# EAGLE design Quad-Load-Cell-Amplifier-to-RS-485-Conv-Module (EAGLE 9.6.2)
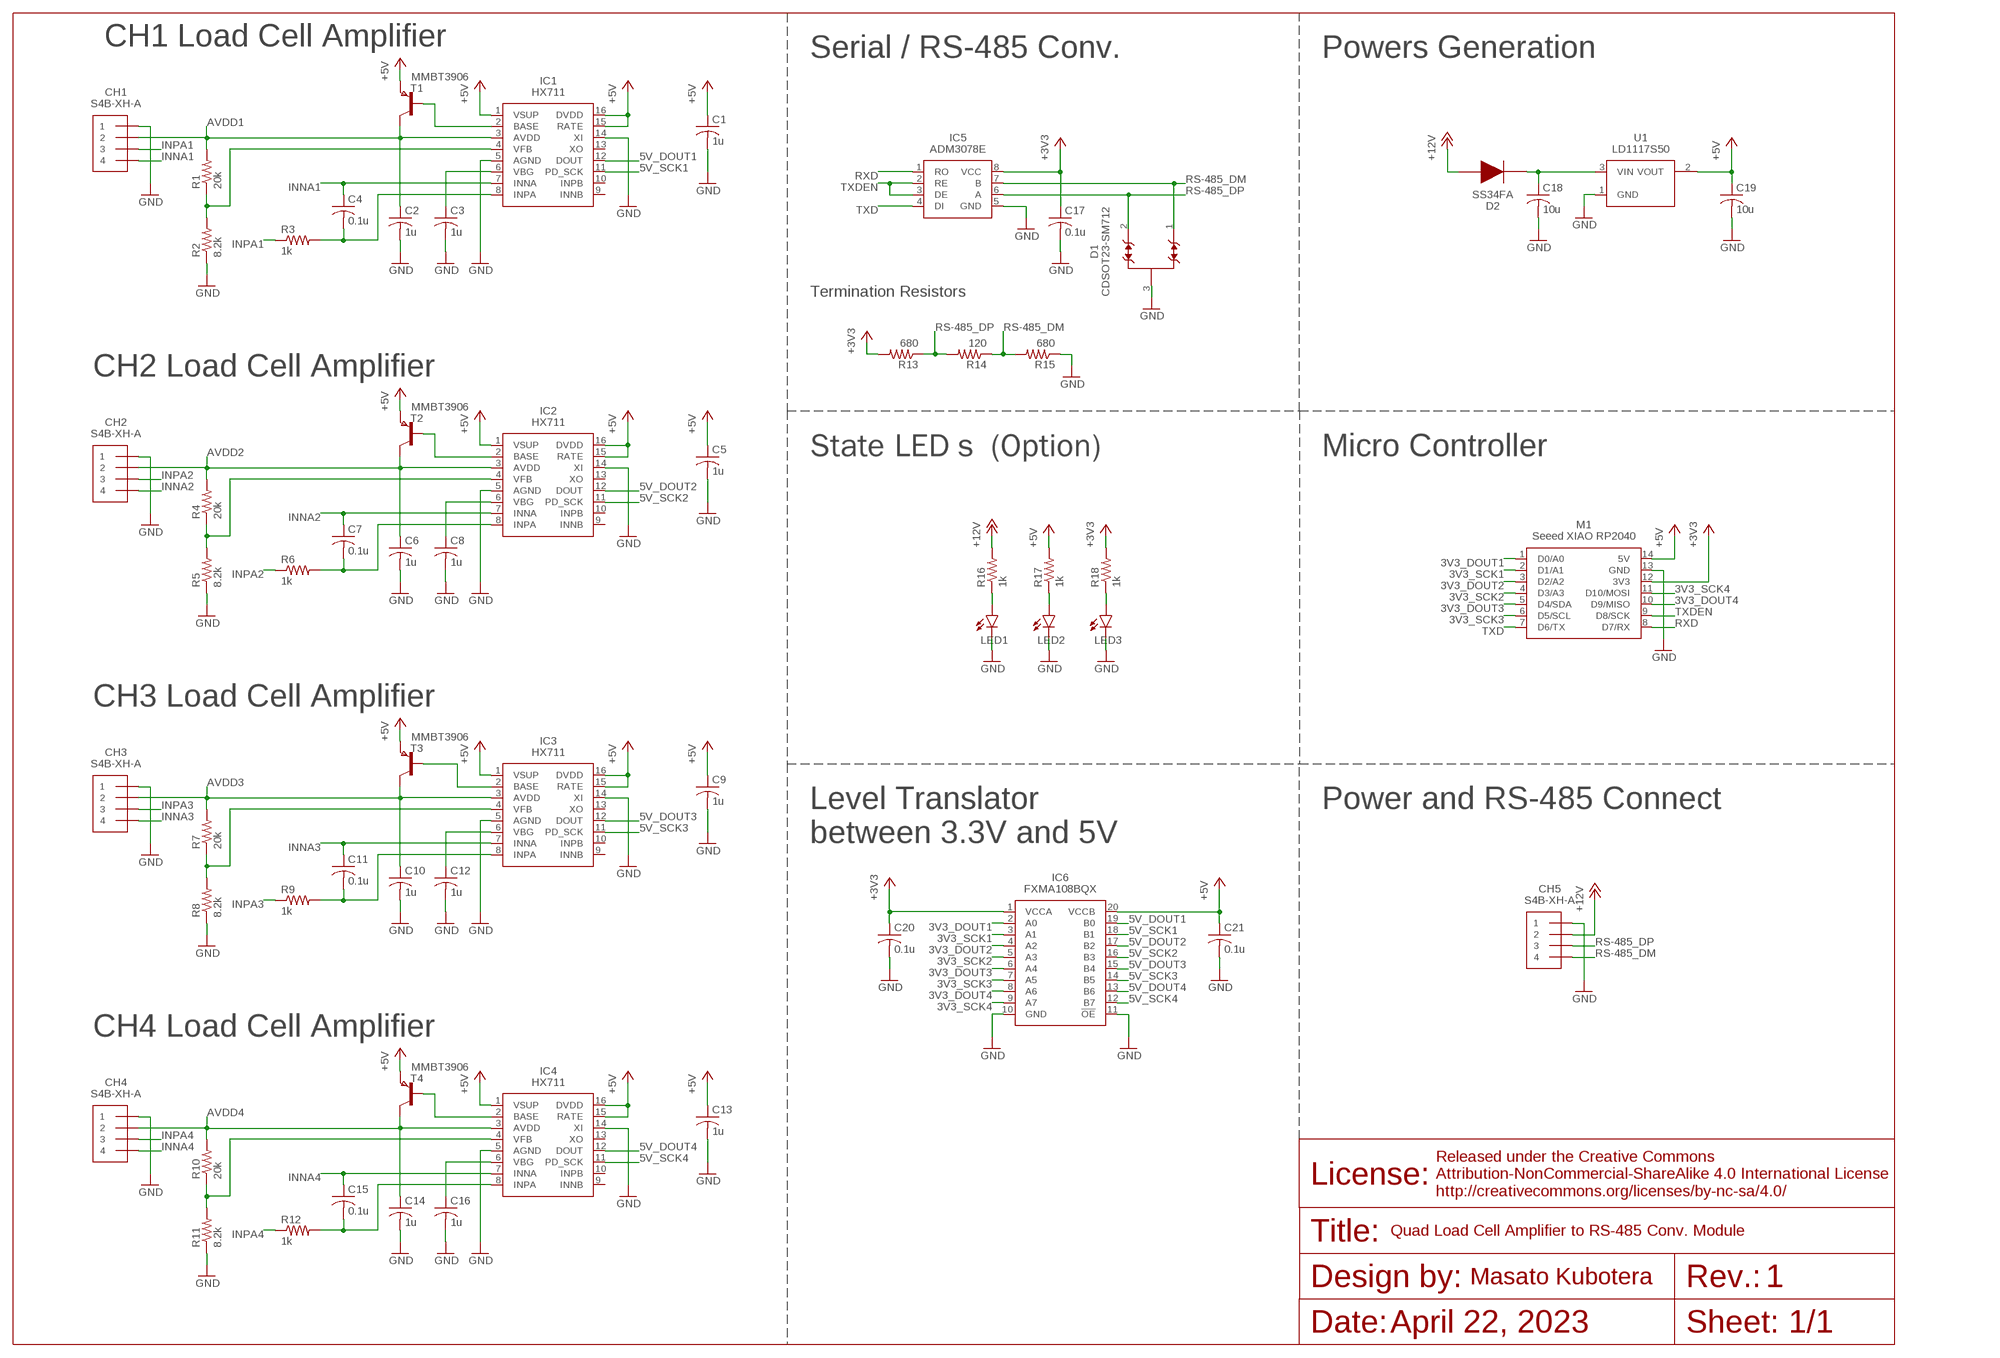
[diagram p0: schematic, sheet 1]

## Parts
C1  1u  C-USC0603  [C0603]
C2  1u  C-USC0603  [C0603]
C3  1u  C-USC0603  [C0603]
C4  0.1u  C-USC0603  [C0603]
C5  1u  C-USC0603  [C0603]
C6  1u  C-USC0603  [C0603]
C7  0.1u  C-USC0603  [C0603]
C8  1u  C-USC0603  [C0603]
C9  1u  C-USC0603  [C0603]
C10  1u  C-USC0603  [C0603]
C11  0.1u  C-USC0603  [C0603]
C12  1u  C-USC0603  [C0603]
C13  1u  C-USC0603  [C0603]
C14  1u  C-USC0603  [C0603]
C15  0.1u  C-USC0603  [C0603]
C16  1u  C-USC0603  [C0603]
C17  0.1u  C-USC0603  [C0603]
C18  10u  C-USC0603  [C0603]
C19  10u  C-USC0603  [C0603]
C20  0.1u  C-USC0603  [C0603]
C21  0.1u  C-USC0603  [C0603]
CH1  S4B-XH-A  [S4B-XH-A]
CH2  S4B-XH-A  [S4B-XH-A]
CH3  S4B-XH-A  [S4B-XH-A]
CH4  S4B-XH-A  [S4B-XH-A]
CH5  S4B-XH-A  [S4B-XH-A]
D1  CDSOT23-SM712  [SOT-23-3]
D2  SS34FA  [SS34FA]
IC1  HX711  [HX711]
IC2  HX711  [HX711]
IC3  HX711  [HX711]
IC4  HX711  [HX711]
IC5  ADM3078E  [ADM3078E]
IC6  FXMA108BQX  [QFN-20]
LED1  LEDSML0603  [SML0603]
LED2  LEDSML0603  [SML0603]
LED3  LEDSML0603  [SML0603]
M1  SEEED_XIAO_RP2040_HOLE  [SEEED_XIAO_HOLE]
R1  20k  R-US_R0603  [R0603]
R2  8.2k  R-US_R0603  [R0603]
R3  1k  R-US_R0603  [R0603]
R4  20k  R-US_R0603  [R0603]
R5  8.2k  R-US_R0603  [R0603]
R6  1k  R-US_R0603  [R0603]
R7  20k  R-US_R0603  [R0603]
R8  8.2k  R-US_R0603  [R0603]
R9  1k  R-US_R0603  [R0603]
R10  20k  R-US_R0603  [R0603]
R11  8.2k  R-US_R0603  [R0603]
R12  1k  R-US_R0603  [R0603]
R13  680  R-US_R0603  [R0603]
R14  120  R-US_R0603  [R0603]
R15  680  R-US_R0603  [R0603]
R16  1k  R-US_R0603  [R0603]
R17  1k  R-US_R0603  [R0603]
R18  1k  R-US_R0603  [R0603]
T1  MMBT3906  PNPSOT23  [SOT-23]
T2  MMBT3906  PNPSOT23  [SOT-23]
T3  MMBT3906  PNPSOT23  [SOT-23]
T4  MMBT3906  PNPSOT23  [SOT-23]
U1  LD1117S50  [SOT-223]

## Nets
3V3_DOUT1: IC6.2(A0) M1.1(D0/A0)
3V3_DOUT2: IC6.4(A2) M1.3(D2/A2)
3V3_DOUT3: IC6.6(A4) M1.5(D4/SDA)
3V3_DOUT4: IC6.8(A6) M1.10(D9/MISO)
3V3_LED [Power]: LED3.A R18.1
3V3_SCK1: IC6.3(A1) M1.2(D1/A1)
3V3_SCK2: IC6.5(A3) M1.4(D3/A3)
3V3_SCK3: IC6.7(A5) M1.6(D5/SCL)
3V3_SCK4: IC6.9(A7) M1.11(D10/MOSI)
5V_DOUT1 [Signal]: IC1.12(DOUT) IC6.19(B0)
5V_DOUT2 [Signal]: IC2.12(DOUT) IC6.17(B2)
5V_DOUT3 [Signal]: IC3.12(DOUT) IC6.15(B4)
5V_DOUT4 [Signal]: IC4.12(DOUT) IC6.13(B6)
5V_LED [Power]: LED2.A R17.1
5V_SCK1 [Signal]: IC1.11(PD_SCK) IC6.18(B1)
5V_SCK2 [Signal]: IC2.11(PD_SCK) IC6.16(B3)
5V_SCK3 [Signal]: IC3.11(PD_SCK) IC6.14(B5)
5V_SCK4 [Signal]: IC4.11(PD_SCK) IC6.12(B7)
12V_LED [Power]: LED1.A R16.1
+3V3 [Power]: C17.1 C20.1 IC5.8(VCC) IC6.1(VCCA) M1.12(3V3) R13.2 R18.2
+5V [Power]: C1.1 C5.1 C9.1 C13.1 C19.1 C21.1 IC1.1(VSUP) IC1.15(RATE) IC1.16(DVDD) IC2.1(VSUP) IC2.15(RATE) IC2.16(DVDD) IC3.1(VSUP) IC3.15(RATE) IC3.16(DVDD) IC4.1(VSUP) IC4.15(RATE) IC4.16(DVDD) IC6.20(VCCB) M1.14(5V) R17.2 T1.2(E) T2.2(E) T3.2(E) T4.2(E) U1.2(VOUT)
+12V [Thick_Power]: CH5.2 D2.2 R16.2
AVDD1 [Signal]: C2.1 CH1.2 IC1.3(AVDD) R1.2 T1.1(C)
AVDD2 [Signal]: C6.1 CH2.2 IC2.3(AVDD) R4.2 T2.1(C)
AVDD3 [Signal]: C10.1 CH3.2 IC3.3(AVDD) R7.2 T3.1(C)
AVDD4 [Signal]: C14.1 CH4.2 IC4.3(AVDD) R10.2 T4.1(C)
BASE1 [Signal]: IC1.2(BASE) T1.3(B)
BASE2 [Signal]: IC2.2(BASE) T2.3(B)
BASE3 [Signal]: IC3.2(BASE) T3.3(B)
BASE4 [Signal]: IC4.2(BASE) T4.3(B)
GND: C1.2 C2.2 C3.2 C5.2 C6.2 C8.2 C9.2 C10.2 C12.2 C13.2 C14.2 C16.2 C17.2 C18.2 C19.2 C20.2 C21.2 CH1.1 CH2.1 CH3.1 CH4.1 CH5.1 D1.3 IC1.5(AGND) IC1.14(XI) IC2.5(AGND) IC2.14(XI) IC3.5(AGND) IC3.14(XI) IC4.5(AGND) IC4.14(XI) IC5.5(GND) IC6.10(GND) IC6.11(!OE) LED1.C LED2.C LED3.C M1.13(GND) R2.1 R5.1 R8.1 R11.1 R15.1 U1.1(GND)
INNA1 [Signal]: C4.1 CH1.4 IC1.7(INNA)
INNA2 [Signal]: C7.1 CH2.4 IC2.7(INNA)
INNA3 [Signal]: C11.1 CH3.4 IC3.7(INNA)
INNA4 [Signal]: C15.1 CH4.4 IC4.7(INNA)
INPA1 [Signal]: CH1.3 R3.1
INPA1_ [Signal]: C4.2 IC1.8(INPA) R3.2
INPA2 [Signal]: CH2.3 R6.1
INPA2_ [Signal]: C7.2 IC2.8(INPA) R6.2
INPA3 [Signal]: CH3.3 R9.1
INPA3_ [Signal]: C11.2 IC3.8(INPA) R9.2
INPA4 [Signal]: CH4.3 R12.1
INPA_ [Signal]: C15.2 IC4.8(INPA) R12.2
RS-485_DM [Signal]: CH5.4 D1.1 IC5.7(B) R14.1 R15.2
RS-485_DP [Signal]: CH5.3 D1.2 IC5.6(A) R13.1 R14.2
RXD [Signal]: IC5.1(RO) M1.8(D7/RX)
TXD [Signal]: IC5.4(DI) M1.7(D6/TX)
TXDEN [Signal]: IC5.2(RE) IC5.3(DE) M1.9(D8/SCK)
VBG1 [Signal]: C3.1 IC1.6(VBG)
VBG2 [Signal]: C8.1 IC2.6(VBG)
VBG3 [Signal]: C12.1 IC3.6(VBG)
VBG4 [Signal]: C16.1 IC4.6(VBG)
VFB1 [Signal]: IC1.4(VFB) R1.1 R2.2
VFB2 [Signal]: IC2.4(VFB) R4.1 R5.2
VFB3 [Signal]: IC3.4(VFB) R7.1 R8.2
VFB4 [Signal]: IC4.4(VFB) R10.1 R11.2
VIN [Power]: C18.1 D2.1 U1.3(VIN)
Unconnected: IC1.9(INNB) IC1.10(INPB) IC1.13(XO) IC2.9(INNB) IC2.10(INPB) IC2.13(XO) IC3.9(INNB) IC3.10(INPB) IC3.13(XO) IC4.9(INNB) IC4.10(INPB) IC4.13(XO)

## Notes on the sheet
- CH1 Load Cell Amplifier
- Serial / RS-485 Conv. | Powers Generation
- Termination Resistors
- CH2 Load Cell Amplifier
- State LEDｓ (Option) | Micro Controller
- CH3 Load Cell Amplifier
- Level Translator
  between 3.3V and 5V
- Power and RS-485 Connect
- CH4 Load Cell Amplifier
- Quad Load Cell Amplifier to RS-485 Conv. Module
- 1
- April 22, 2023 | 1/1

## Library data of the parts
C1-C21 = rcl:C-US: CAPACITOR, American symbol; SPICEPREFIX: C
CH1-CH5 = JST-XH:S4B-XH-A
D1 = CDSOT23-SM712:CDSOT23-SM712
D2 = SS34FA:SS34FA
IC1-IC4 = HX711:HX711
IC5 = ADM3078E:ADM3078E
IC6 = FXMA108BQX:FXMA108BQX
LED1-LED3 = led:LED: LED OSRAM: - CHIPLED LG R971, LG N971, LY N971, LG Q971, LY Q971, LO R971, LY R971 LH N974, LH R974 LS Q976, LO Q976, LY Q976 LO Q996 - Hyper CHIPLED LW Q18S LB Q993, LB Q99A, LB R99A - SideLED LS A670, LO A670, LY A670, LG A670, LP A670 LB A673, LV A673, LT A673, LW A673 LH A674 LY A675 LS A676, LA A676, LO A676, LY A676, LW A676 LS A679, LY A679, LG A679 - Hyper Micro SIDELED® LS Y876, LA Y876, LO Y876, LY Y876 LT Y87S - SmartLED LW L88C, LW L88S LB L89C, LB L89S, LG L890 LS L89K, LO L89K, LY L89K LS L896, LA L896, LO L896, LY L896 - TOPLED LS T670, LO T670, LY T670, LG T670, LP T670 LSG T670, LSP T670, LSY T670, LOP T670, LYG T670 LG T671, LOG T671, LSG T671 LB T673, LV T673, LT T673, LW T673 LH T674 LS T676, LA T676, LO T676, LY T676, LB T676, LH T676, LSB T676, LW T676 LB T67C, LV T67C, LT T67C, LS T67K, LO T67K, LY T67K, LW E67C LS E67B, LA E67B, LO E67B, LY E67B, LB E67C, LV E67C, LT E67C LW T67C LS T679, LY T679, LG T679 LS T770, LO T770, LY T770, LG T770, LP T770 LB T773, LV T773, LT T773, LW T773 LH T774 LS E675, LA E675, LY E675, LS T675 LS T776, LA T776, LO T776, LY T776, LB T776 LHGB T686 LT T68C, LB T68C - Hyper Mini TOPLED® LB M676 - Mini TOPLED Santana® LG M470 LS M47K, LO M47K, LY M47K Source: http://www.osram.convergy.de LUXEON: - LUMILED® LXK2-PW12-R00, LXK2-PW12-S00, LXK2-PW14-U00, LXK2-PW14-V00 LXK2-PM12-R00, LXK2-PM12-S00, LXK2-PM14-U00 LXK2-PE12-Q00, LXK2-PE12-R00, LXK2-PE12-S00, LXK2-PE14-T00, LXK2-PE14-U00 LXK2-PB12-K00, LXK2-PB12-L00, LXK2-PB12-M00, LXK2-PB14-N00, LXK2-PB14-P00, LXK2-PB14-Q00 LXK2-PR12-L00, LXK2-PR12-M00, LXK2-PR14-Q00, LXK2-PR14-R00 LXK2-PD12-Q00, LXK2-PD12-R00, LXK2-PD12-S00 LXK2-PH12-R00, LXK2-PH12-S00 LXK2-PL12-P00, LXK2-PL12-Q00, LXK2-PL12-R00 Source: www.luxeon.com KINGBRIGHT: KA-3528ASYC Source: www.kingbright.com
M1 = Seeed_XIAO:SEEED_XIAO_RP2040_HOLE
R1-R18 = rcl:R-US_: RESISTOR, American symbol; SPICEPREFIX: R
T1-T4 = zetex:PNPSOT23: PNP TRANSISTOR; MPN: DSS20200L-7; OC_FARNELL: unknown; OC_NEWARK: 25R4554
U1 = LD1117S50:LD1117S50

## Net classes
0 default: width 0.203 mm
1 Power: width 0.254 mm
2 Thick_Power: width 0.406 mm
3 Signal: width 0.203 mm

## Board
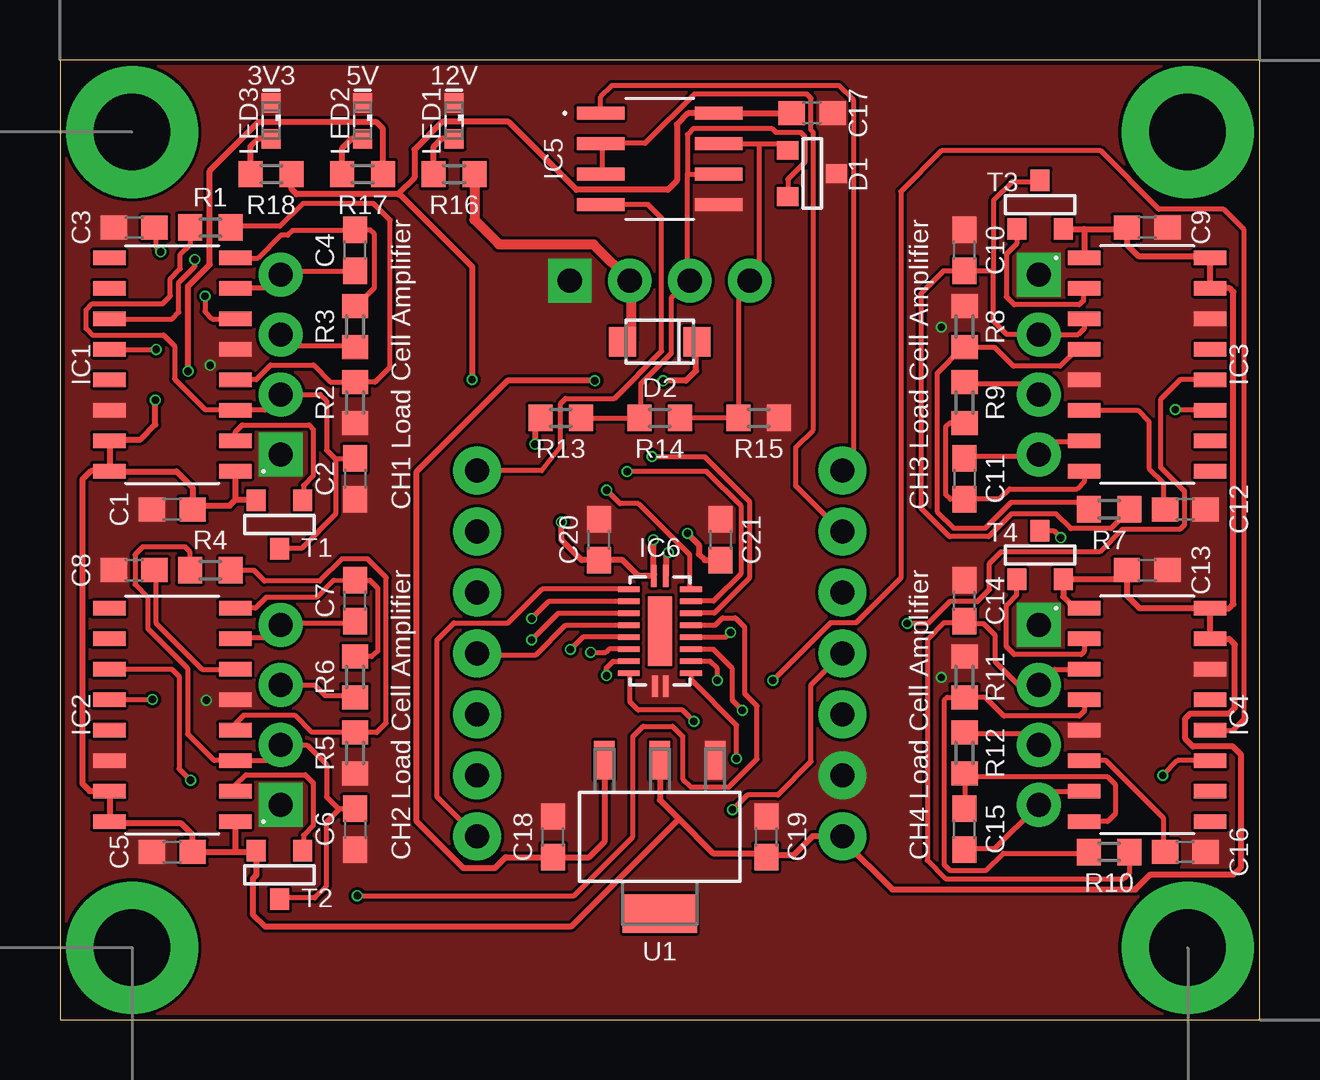
[diagram p1: board, top side]
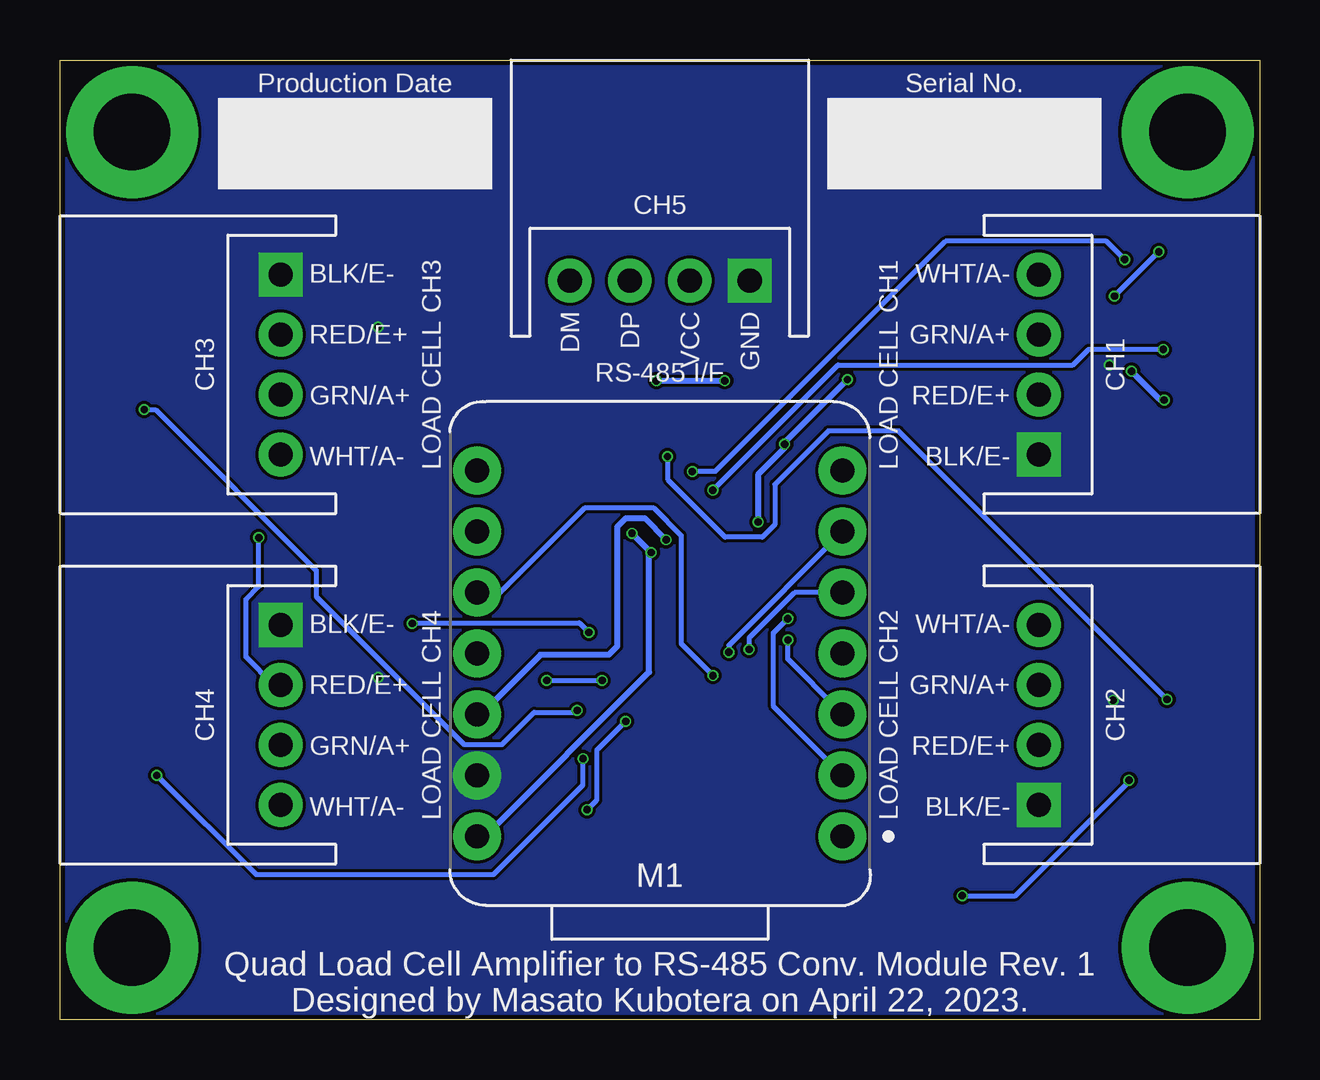
[diagram p2: board, bottom side, seen from below]

Size 50 x 40 mm. Coordinates in mm from the lower left corner, seen from the top.
Outline: 0,0 50,0 50,40 0,40 0,0
Copper layers (1*16): Top 0.035mm / dielectric 1.6mm / Bottom 0.035mm
Design rules "jlcpcb-2layers": minimum track width 5mil, minimum drill 0.3mm, track to track 5mil, track to pad 5mil, pad to pad 5mil, via to via 5mil, smd to smd 5mil, copper to edge 0.2mm, drill to drill 6mil, minimum pad ring 10mil, minimum via ring 3mil, stop-mask expansion 4mil, vias tented up to drill 0mil, thermal gap 10mil

### Footprints (pad centres in the part's own frame; a part is rotated, then mirrored left to right if it is on the bottom)
C0603 = smd 1.1 x 1: 1 -0.85,0; 2 0.85,0
S4B-XH-A = drill 1.016 square: 1 3.75,0 | drill 1.016: 2 1.25,0; 3 -1.25,0; 4 -3.75,0
SOT-23-3 = smd 0.787 x 0.889: 1 0.991,1.016; 2 -0.94,1.016; 3 0.025,-1.016
SS34FA = smd 1.12 x 1.22: 1 -1.55,0; 2 1.55,0
HX711 = smd 1.35 x 0.6: 1 -2.625,4.445; 2 -2.625,3.175; 3 -2.625,1.905; 4 -2.625,0.635; 5 -2.625,-0.635; 6 -2.625,-1.905; 7 -2.625,-3.175; 8 -2.625,-4.445; 9 2.625,-4.445; 10 2.625,-3.175; 11 2.625,-1.905; 12 2.625,-0.635; 13 2.625,0.635; 14 2.625,1.905; 15 2.625,3.175; 16 2.625,4.445
ADM3078E = smd 1.981 x 0.533: 1 -2.464,1.905; 2 -2.464,0.635; 3 -2.464,-0.635; 4 -2.464,-1.905; 5 2.464,-1.905; 6 2.464,-0.635; 7 2.464,0.635; 8 2.464,1.905
QFN-20 = smd 0.9 x 0.24: 1 -2.3,-0.25; 10 2.3,-0.2; 11 2.3,0.25; 20 -2.3,0.25 | smd 0.24 x 0.9: 2 -1.75,-1.3; 3 -1.25,-1.3; 4 -0.75,-1.3; 5 -0.25,-1.3; 6 0.25,-1.3; 7 0.75,-1.3; 8 1.25,-1.3; 9 1.75,-1.3; 12 1.75,1.3; 13 1.25,1.3; 14 0.75,1.3; 15 0.25,1.3; 16 -0.25,1.3; 17 -0.75,1.3; 18 -1.25,1.3; 19 -1.75,1.3 | smd 2.9 x 1: 21 0,0
SML0603 = smd 0.8 x 0.8: A 0.75,0; C -0.75,0
SEEED_XIAO_HOLE = drill 1 pad 2: 1 -7.62,-2.88; 2 -7.62,-5.42; 3 -7.62,-7.96; 4 -7.62,-10.5; 5 -7.62,-13.04; 6 -7.62,-15.58; 7 -7.62,-18.12; 8 7.62,-18.12; 9 7.62,-15.58; 10 7.62,-13.04; 11 7.62,-10.5; 12 7.62,-7.96; 13 7.62,-5.42; 14 7.62,-2.88
R0603 = smd 1 x 1.1: 1 -0.85,0; 2 0.85,0
SOT-23 = smd 0.787 x 0.889: 1 0.025,-1.016; 2 -0.94,1.016; 3 0.991,1.016
SOT-223 = smd 1.6 x 0.838: 1 -3.2,2.311; 2 -3.2,0; 3 -3.2,-2.311 | smd 1.6 x 3.099: 4 3.2,0

### Placement (x,y rotation side)
C1  4.68,21.27 180 top
C2  12.3,22.54 270 top
C3  3.09,33.02 180 top
C4  12.3,32.06 90 top
C5  4.68,6.98 180 top
C6  12.3,7.94 270 top
C7  12.3,17.46 90 top
C8  3.09,18.73 180 top
C9  45.32,33.02 0 top
C10  37.7,32.06 90 top
C11  37.7,22.54 270 top
C12  46.91,21.27 0 top
C13  45.32,18.73 0 top
C14  37.7,17.46 90 top
C15  37.7,7.94 90 top
C16  46.91,6.98 0 top
C17  31.35,37.78 0 top
C18  20.55,7.62 90 top
C19  29.45,7.62 90 top
C20  22.46,20 90 top
C21  27.54,20 90 top
CH1  9.2,27.3 270 bottom
CH2  9.2,12.7 270 bottom
CH3  40.8,27.3 90 bottom
CH4  40.8,12.7 90 bottom
CH5  25,30.8 0 bottom
D1  31.35,35.24 90 top
D2  25,28.26 180 top
IC1  4.68,27.3 180 top
IC2  4.68,12.7 180 top
IC3  45.32,27.3 0 top
IC4  45.32,12.7 0 top
IC5  25,35.88 0 top
IC6  25,16.19 270 top
LED1  16.43,37.46 270 top
LED2  12.62,37.46 270 top
LED3  8.81,37.46 270 top
M1  25,4.76 180 bottom
R1  6.27,33.02 180 top
R2  12.3,25.71 90 top
R3  12.3,28.89 90 top
R4  6.27,18.73 180 top
R5  12.3,11.11 90 top
R6  12.3,14.29 90 top
R7  43.73,21.27 0 top
R8  37.7,28.89 270 top
R9  37.7,25.71 270 top
R10  43.73,6.98 0 top
R11  37.7,14.29 270 top
R12  37.7,11.11 270 top
R13  20.87,25.08 180 top
R14  25,25.08 180 top
R15  29.13,25.08 180 top
R16  16.43,35.24 0 top
R17  12.62,35.24 0 top
R18  8.81,35.24 0 top
T1  9.12,20.64 0 top
T2  9.12,6.03 0 top
T3  40.88,33.97 180 top
T4  40.88,19.36 180 top
U1  25,7.62 270 top

### Tracks (layer width: path | path; a pad name or v marks a point on that pad's centre or on a via)
3V3_DOUT1
  Top 0.203: IC6.2 20.09,17.95 18.68,16.53 16.42,16.53 15.71,15.82 15.71,9.28 17.36,7.64 M1.1
3V3_DOUT2  (via drill 0.3)
  Top 0.203: IC6.4 20.77,16.94 v19.66,15.82
  Bottom 0.203: v19.66,15.82 19.66,15.03 17.52,12.9 M1.3
3V3_DOUT3  (via drill 0.3)
  Top 0.203: IC6.6 21.8,15.94 21.76,15.9 21.75,15.9 v21.28,15.43
  Bottom 0.203: v21.28,15.43 21.28,15.9 19.38,17.8 M1.5
3V3_DOUT4  (via drill 0.3)
  Top 0.203: v22.78,14.34 22.78,14.66 23.05,14.93 23.67,14.93 IC6.8
  Bottom 0.203: v22.78,14.34 24.11,15.67 24.11,20.18 25.27,21.33 28.11,21.33 31.67,17.78 32.56,17.78 M1.10
3V3_LED
  Top 0.254: LED3.A 8.25,36.71 7.96,36.42 R18.1
3V3_SCK1  (via drill 0.3)
  Top 0.203: v19.67,16.71 20.39,17.44 IC6.3
  Bottom 0.203: v19.67,16.71 20.28,16.1 20.28,13.08 M1.2
3V3_SCK2
  Top 0.203: IC6.5 23.67,16.44 21.08,16.44 19.83,15.2 17.44,15.2 M1.4
3V3_SCK3  (via drill 0.3)
  Top 0.203: IC6.7 22.89,15.44 22.76,15.31 v22.12,15.31
  Bottom 0.203: v22.12,15.31 22.12,15.6 M1.6
3V3_SCK4  (via drill 0.3)
  Top 0.203: v26.42,12.43 25.95,12.9 24.09,12.9 23.75,13.24 23.75,14.4 IC6.9 | M1.11 32.56,15.2 31.31,13.96 31.31,10.75 29.92,9.36 28.65,9.36 v28.03,8.75
  Bottom 0.203: v26.42,12.43 27.63,11.22 27.63,9.14 v28.03,8.75
5V_DOUT1  (via drill 0.3)
  Top 0.203: v22.79,22.06 23.35,21.51 24.11,21.51 26.25,19.38 26.25,17.95 IC6.19 | v4.01,27.93 v4.01,27.94 IC1.12
  Bottom 0.203: v22.79,22.06 17.56,27.29 7.77,27.29 7.13,27.93 v4.01,27.93
5V_DOUT2  (via drill 0.3)
  Top 0.203: v24.68,23.47 26.87,23.47 28.73,21.6 28.73,18.4 27.27,16.94 IC6.17 | v3.86,13.34 3.86,13.33 IC2.12
  Bottom 0.203: v24.68,23.47 24.68,22.52 22.28,20.11 20.72,20.11 20.21,20.63 20.21,22.3 17.98,24.53 15.04,24.53 v3.86,13.34
5V_DOUT3  (via drill 0.3)
  Top 0.203: IC6.15 27.76,15.94 v27.96,16.14 | v35.32,16.51 36.18,16.51 37.09,17.42 38.25,17.42 38.75,17.92 38.75,19.01 39.23,19.49 43.33,19.49 44.29,20.45 46.69,20.45 46.87,20.62 46.87,22.02 45.87,23.03 45.87,25.84 46.69,26.67 IC3.12
  Bottom 0.203: v27.96,16.14 28.35,16.53 35.3,16.53 v35.32,16.51
5V_DOUT4  (via drill 0.3)
  Top 0.203: v27.4,14.13 27.4,14.63 27.09,14.93 26.33,14.93 IC6.13 | v29.71,14.13 v29.71,14.14 32.11,16.53 33.18,16.53 35.05,18.41 35.05,34.52 36.74,36.21 43.38,36.21 45.81,33.78 48.5,33.78 49.36,32.92 49.36,12.54 48.88,12.06 IC4.12
  Bottom 0.203: v29.71,14.13 v27.4,14.13
5V_LED
  Top 0.254: R17.1 11.77,36.33 12.15,36.71 LED2.A
5V_SCK1  (via drill 0.3)
  Top 0.203: IC6.18 27.24,17.44 28.38,18.58 28.38,21.42 26.96,22.84 v23.64,22.84 | IC1.11 4.68,29.21 4.95,29.48 4.95,30.73 5.62,31.39 v5.62,31.68
  Bottom 0.203: v23.64,22.84 22.69,22.84 13.09,32.45 6.38,32.45 v5.62,31.68
5V_SCK2  (via drill 0.3)
  Top 0.203: v12.39,5.16 21.42,5.16 23.88,7.62 23.88,11.8 24.31,12.23 25.53,12.23 25.95,11.81 25.95,10.04 26.3,9.69 27.89,9.69 29.06,10.86 29.06,13.07 28.54,13.59 28.54,16.36 28.15,16.75 27.62,16.75 27.31,16.44 IC6.16 | v5.44,9.98 4.96,10.45 4.96,14.31 4.67,14.6 IC2.11
  Bottom 0.203: v5.44,9.98 5.44,9.9 10.17,5.16 v12.39,5.16
5V_SCK3  (via drill 0.3)
  Top 0.203: IC6.14 27.21,15.44 28.02,14.63 28.02,13.3 v28.44,12.89 | IC3.11 47.95,25.43 v46.49,25.43
  Bottom 0.203: v28.44,12.89 28.52,12.81 30.24,12.81 31.58,11.47 33.15,11.47 39.31,17.63 39.31,18.73 46.01,25.43 v46.49,25.43
5V_SCK4  (via drill 0.3)
  Top 0.203: IC6.12 26.3,14.17 28.2,12.27 v28.2,10.88 | v45.97,10.18 46.58,10.79 IC4.11
  Bottom 0.203: v28.2,10.88 28.2,9.78 31.93,6.04 41.83,6.04 v45.97,10.18
12V_LED
  Top 0.254: LED1.A 15.9,36.71 15.58,36.39 R16.1
+3V3  (via drill 0.3)
  Top 0.254: 14.07,34.4 9.86,34.4 9.66,34.61 R18.2 | 14.07,34.4 14.15,34.4 17.18,31.38 v17.18,26.68 | 14.07,34.4 14.78,35.1 14.78,36.27 15.93,37.42 18.69,37.42 21.52,34.59 25.33,34.59 25.71,34.97 25.71,37.31 26.18,37.78 IC5.8 C17.1 | R13.2 19.79,24.85 v19.79,23.98 | v20.9,20.74 20.9,20 21.75,19.15 C20.1 23.45,19.15 24.11,18.49 IC6.1 24.73,18.67 v24.73,20
  Bottom 0.254: v20.9,20.74 20.9,22.71 19.79,23.83 v19.79,23.98 v19.8,23.99 19.8,24.06 v17.18,26.68 | v24.73,20 25.62,20.89 26.42,20.89 26.78,20.53 26.78,15.55 27.13,15.2 29.97,15.2 32.37,12.8 32.56,12.8 M1.12
+5V  (via drill 0.3)
  Top 0.254: 8.11,7.38 8.11,7.11 | 8.11,7.11 T2.2 8.18,6.01 8.04,5.87 8.04,4.39 8.56,3.87 21.3,3.87 25.79,8.36 | 7.31,8.18 IC2.1 | 7.2,8.25 IC2.1 | T1.2 7.3,21.65 | IC1.1 7.3,21.65 | C1.1 5.53,21.33 5.53,22.18 4.86,22.84 2.15,22.84 IC1.16 | v5.33,27.02 5.33,30.57 6.24,31.48 6.24,35.38 8.29,37.42 13.18,37.42 13.44,37.16 13.44,35.29 R17.2 | v3.98,25.83 3.98,24.79 3.36,24.18 2.06,24.18 IC1.15 2.06,24 2.06,22.93 IC1.16 | 5.44,21.42 C1.1 | IC1.16 1.28,22.86 0.93,22.5 0.93,9.83 1.24,9.52 IC2.15 2.06,9.51 2.06,8.27 IC2.16 2.15,8.18 5.05,8.18 5.05,8.17 5.53,7.7 C5.1 7.3,6.98 | T3.2 42.7,32.95 | 42.7,32.95 IC3.1 42.78,31.91 | 44.47,32.98 C9.1 | C9.1 44.47,32.3 44.95,31.82 47.85,31.82 IC3.16 47.94,31.73 47.94,30.49 IC3.15 48.76,30.48 48.91,30.32 48.91,17.32 48.74,17.14 IC4.16 | C9.1 44.56,32.89 44.49,32.95 42.7,32.95 | IC4.16 47.94,17.07 47.94,15.91 IC4.15 48.74,15.87 48.98,15.63 48.98,13 48.74,12.75 47.11,12.75 46.91,12.56 46.91,11.69 47.23,11.38 48.89,11.38 49.23,11.04 49.23,6.35 48.93,6.04 45.45,6.04 44.83,5.42 34.69,5.42 32.64,7.46 M1.14 31.37,7.64 30.57,6.84 29.45,6.84 C19.1 29.36,6.93 27.22,6.93 25.79,8.36 | 44.47,18.67 C13.1 | IC4.16 47.85,17.16 44.99,17.16 44.47,17.68 C13.1 | v26.16,20.27 26.63,19.79 26.63,19.39 26.88,19.15 C21.1 | v25.36,19.47 25.25,19.36 IC6.20 | U1.2 25,9.15 25.79,8.36 | C13.1 44.09,18.35 T4.2 41.81,17.63 42.3,17.14 IC4.1 | 7.3,6.98 7.98,6.98 8.11,7.11 | IC2.1 7.3,6.99 7.3,6.98 | 7.3,21.65 7.08,21.42 5.68,21.42 C1.1
  Bottom 0.254: v5.33,27.02 4.14,25.83 v3.98,25.83 | v26.16,20.27 v25.36,19.47 25.45,19.38 25.45,14.49 32.29,7.64 32.56,7.64 M1.14
+12V
  Top 0.406: R16.2 17.28,33.34 18.3,32.31 22.24,32.31 CH5.2 23.81,30.74 23.81,28.37 D2.2
AVDD1
  Top 0.203: T1.1 9.18,19.64 10.07,19.64 11.49,21.06 11.49,23.35 11.46,23.38 | R1.2 5.42,32.3 5.02,31.91 5.02,31.3 4.6,30.88 4.6,30.16 4.28,29.84 1.35,29.84 1.09,29.58 1.09,28.8 1.35,28.53 4.32,28.53 4.77,28.08 4.77,26.7 6.05,25.42 7.22,25.42 IC1.3 8.55,25.4 CH1.2 10.85,26.05 11.11,25.79 11.11,23.73 11.46,23.38 | 12.02,23.2 C2.1 12.29,23.38 11.46,23.38
AVDD2
  Top 0.203: 11.63,8.77 11.65,8.79 C6.1 11.77,8.79 | 11.63,8.77 11.09,8.23 11.09,5.53 10.62,5.06 9.18,5.06 T2.1 | R4.2 5.42,19.48 5.19,19.71 3.47,19.71 3.13,19.38 3.13,18.13 3.66,17.6 3.66,16.3 5.32,14.64 5.32,11.9 6.43,10.79 IC2.3 8.57,10.79 9.2,11.42 CH2.2 | 9.64,11.45 CH2.2 | CH2.2 10.3,11.45 11.11,10.63 11.11,9.28 11.63,8.77
AVDD3
  Top 0.203: 38.91,31.21 38.91,34.15 39.69,34.94 40.82,34.94 T3.1 | C10.1 38.91,31.21 | C10.1 37.71,31.29 37.89,31.47 C10.1 | 44.29,21.25 44.56,21.25 R7.2 44.58,21.24 43.8,20.47 42.13,20.47 41.51,21.08 39.66,21.08 38.71,20.13 37.08,20.13 35.88,21.32 35.88,30.26 36.84,31.21 C10.1 | 38.91,31.21 38.91,29.11 39.47,28.55 CH3.2 42.44,28.55 42.7,28.8 IC3.3
AVDD4  (via drill 0.3)
  Top 0.203: v41.71,20.09 41.45,20.36 40.91,20.36 T4.1 | 37.71,16.53 C14.1 | R10.2 44.58,6.11 44.34,5.87 36.91,5.87 36.15,6.63 36.15,15.85 36.83,16.53 37.62,16.53 C14.1 | 42.69,14.58 IC4.3 41.45,14.6 CH4.2 39.94,13.95 38.97,14.92 38.97,16.03 38.49,16.51 37.8,16.51 C14.1
  Bottom 0.203: v41.71,20.09 41.71,18.04 42.25,17.51 42.25,15.11 41.09,13.96 40.82,13.96 CH4.2
BASE1
  Top 0.203: IC1.2 7.3,24.49 7.59,24.78 10.38,24.78 10.56,24.6 10.56,22.67 10.15,22.26 10.15,21.69 T1.3
BASE2
  Top 0.203: IC2.2 7.3,9.75 7.75,10.2 10.22,10.2 10.56,9.87 10.56,8.09 10.15,7.68 10.15,7.11 T2.3
BASE3
  Top 0.203: IC3.2 42.67,29.98 42.48,29.8 39.78,29.8 39.44,30.13 39.44,31.9 39.88,32.34 T3.3
BASE4
  Top 0.203: T4.3 39.88,17.71 39.44,17.27 39.44,15.55 39.78,15.22 42.56,15.22 42.7,15.35 IC4.2
GND  (via drill 0.3)
  other vias: 36.74,28.86 36.74,14.26 6.1,13.31 6.26,27.28
  pour Top (no thermals): -0.4,40.32 -0.4,-0.32 50.4,-0.32 50.4,40.32
  pour Bottom (no thermals): -1.04,40.95 -1.04,-0.95 51.03,-0.95 51.03,40.95
HOLE1  (via drill 3.2 pad 5.5)
  other vias: 3,37
HOLE2  (via drill 3.2 pad 5.5)
  other vias: 3,3
HOLE3  (via drill 3.2 pad 5.5)
  other vias: 47,37
HOLE4  (via drill 3.2 pad 5.5)
  other vias: 47,3
INNA1
  Top 0.203: C4.1 12.29,31.2 9.35,31.2 9.27,31.11 CH1.4 9.18,31.02 8.64,30.49 IC1.7
INNA2
  Top 0.203: C7.1 12.29,16.53 9.27,16.53 CH2.4 9.18,16.36 8.73,15.91 7.31,15.91 IC2.7
INNA3
  Top 0.203: C11.1 37.71,23.47 40.73,23.47 CH3.4 40.82,23.64 41.27,24.09 42.69,24.09 IC3.7
INNA4
  Top 0.203: C15.1 37.71,7.11 38.96,7.11 40.73,8.89 CH4.4 41.36,9.51 IC4.7
INPA1
  Top 0.203: R3.1 12.29,28.09 9.71,28.09 9.27,28.53 CH1.3
INPA1_
  Top 0.203: R3.2 12.38,29.78 13.09,30.5 13.09,32.76 12.94,32.91 C4.2 12.28,32.89 9.69,32.89 9.5,32.7 9.21,32.7 8.26,31.75 IC1.8
INPA2
  Top 0.203: CH2.3 10.61,13.95 11.05,13.51 12.29,13.51 R6.1
INPA2_
  Top 0.203: R6.2 12.99,15.13 13.25,15.35 13.25,17.99 12.92,18.31 C7.2 11.41,18.32 10.69,17.6 8.59,17.6 8.15,17.16 7.31,17.16 IC2.8
INPA3
  Top 0.203: R9.1 37.71,26.49 40.38,26.49 40.73,26.13 CH3.3
INPA3_
  Top 0.203: R9.2 37.1,24.87 36.91,24.71 36.91,21.88 37.11,21.69 C11.2 39.15,21.69 39.59,22.12 42.4,22.12 42.7,22.42 IC3.8
INPA4
  Top 0.203: CH4.3 40.8,11.91 37.71,11.91 R12.1
INPA_
  Top 0.203: C15.2 37.71,8.8 37.71,10.22 R12.2 37.8,10.13 43.65,10.13 43.99,9.8 43.99,8.57 43.67,8.25 IC4.8
RS-485_DM
  Top 0.203: D1.1 30.33,36.27 30.29,36.27 30.05,36.51 29.13,36.51 | R14.1 25.89,25.07 28.2,25.07 R15.2 28.29,25.16 28.29,30.31 28.73,30.76 CH5.4 28.81,30.84 | 28.82,30.85 28.81,30.84 | IC5.7 29.13,36.51 | 29.13,36.51 29.13,31.16 28.81,30.84
RS-485_DP
  Top 0.203: R13.1 R14.2 24.15,25.57 24.2,25.64 24.2,26.49 25.47,27.76 25.47,30.07 26.16,30.76 CH5.3 26.25,30.85 26.16,30.94 26.16,35.24 | D1.2 30.33,35.02 31.05,35.73 31.05,36.8 30.87,36.98 29.84,36.98 29.67,37.15 26.41,37.15 26.16,36.89 26.16,35.24 | 27.05,35.29 27.4,35.29 IC5.6 26.16,35.24
RXD
  Top 0.203: IC5.1 22.54,38.46 23.01,38.94 32.47,38.94 33.09,38.31 33.09,23.38 32.64,22.93 M1.8
TXD
  Top 0.203: IC5.4 24.52,33.97 25.08,33.41 25.08,27.86 23.11,25.89 21.07,25.89 20.87,25.67 20.87,23.88 20.08,22.88 M1.7
TXDEN
  Top 0.203: IC5.3 22.6,35.29 22.6,36.45 IC5.2 22.55,36.53 24.39,36.53 26.44,38.58 31.13,38.58 31.31,38.4 31.31,37.07 31.4,36.98 31.4,24.58 30.68,23.85 30.68,22.23 32.56,20.36 M1.9
VBG1  (via drill 0.3)
  Top 0.203: v4.2,32 4.02,32.18 4.02,32.98 C3.1 | v6.05,30.15 6.05,29.52 6.35,29.21 IC1.6
  Bottom 0.203: v6.05,30.15 v4.2,32
VBG2
  Top 0.203: C8.1 4.02,18.67 4.02,16.51 5.93,14.6 IC2.6
VBG3
  Top 0.203: C12.1 45.98,21.33 45.98,22.38 45.39,22.97 45.39,24.92 44.92,25.4 IC3.6
VBG4
  Top 0.203: C16.1 45.98,7.02 45.98,8.41 43.6,10.79 IC4.6
VFB1
  Top 0.203: IC1.4 8.18,26.67 8.78,27.29 10.57,27.29 11.27,26.58 12.29,26.58 R2.2 13.13,26.57 13.76,27.2 13.76,33.33 13.07,34.02 10.12,34.02 9.18,33.07 7.13,33.07 R1.1
VFB2
  Top 0.203: IC2.4 7.3,12.32 7.67,12.69 9.78,12.69 10.47,12 12.29,12 R5.2 13.21,11.96 13.6,12.36 13.6,18.42 12.82,19.2 11.75,19.2 10.83,18.28 8.52,18.28 8.07,18.73 R4.1
VFB3
  Top 0.203: IC3.4 42.4,27.94 41.69,27.23 39.74,27.23 38.97,28 37.71,28 R8.2 37.62,28 36.56,26.93 36.56,21.18 37.26,20.48 38.56,20.48 39.64,21.56 42.59,21.56 R7.1
VFB4
  Top 0.203: IC4.4 42.7,12.86 42.48,12.65 39.35,12.65 38.58,13.42 37.71,13.42 R11.2 36.99,13.43 36.85,13.3 36.85,6.46 37.09,6.22 38.6,6.22 39.31,6.93 42.87,6.93 R10.1
VIN  (via drill 0.3)
  Top 0.254: U1.3 22.69,7.41 22.05,6.77 C18.1 18.57,6.77 18.12,6.31 16.82,6.31 14.87,8.26 14.87,22.85 18.65,26.63 v22.29,26.63 | v25.14,26.63 26.09,26.63 26.51,27.05 26.51,28.18 D2.1
  Bottom 0.254: v25.14,26.63 v22.29,26.63

### Text on the board
tPlace: 3V3 | 5V | 12V | CH1 Load Cell Amplifier | CH3 Load Cell Amplifier | CH2 Load Cell Amplifier | CH4 Load Cell Amplifier
bPlace: Serial No. | Production Date | WHT/A- | BLK/E- | GND | VCC | DP | DM | GRN/A+ | RED/E+ | LOAD CELL CH1 | RS-485 I/F | LOAD CELL CH3 | RED/E+ | GRN/A+ | BLK/E- | WHT/A- | WHT/A- | BLK/E- | GRN/A+ | RED/E+ | LOAD CELL CH2 | LOAD CELL CH4 | RED/E+ | GRN/A+ | BLK/E- | WHT/A- | Quad Load Cell Amplifier to RS-485 Conv. Module Rev. 1 / Designed by Masato Kubotera on April 22, 2023.